# Altium schematic sheet NIM_to_LVCMOS.SchDoc: NIM Receiver
size A; Date: 2023/02/01; DrawnBy: dgl/anp; Organization: Boston University; DocumentNumber: 1; Revision: 1; SheetNumber: 1; SheetTotal: 1
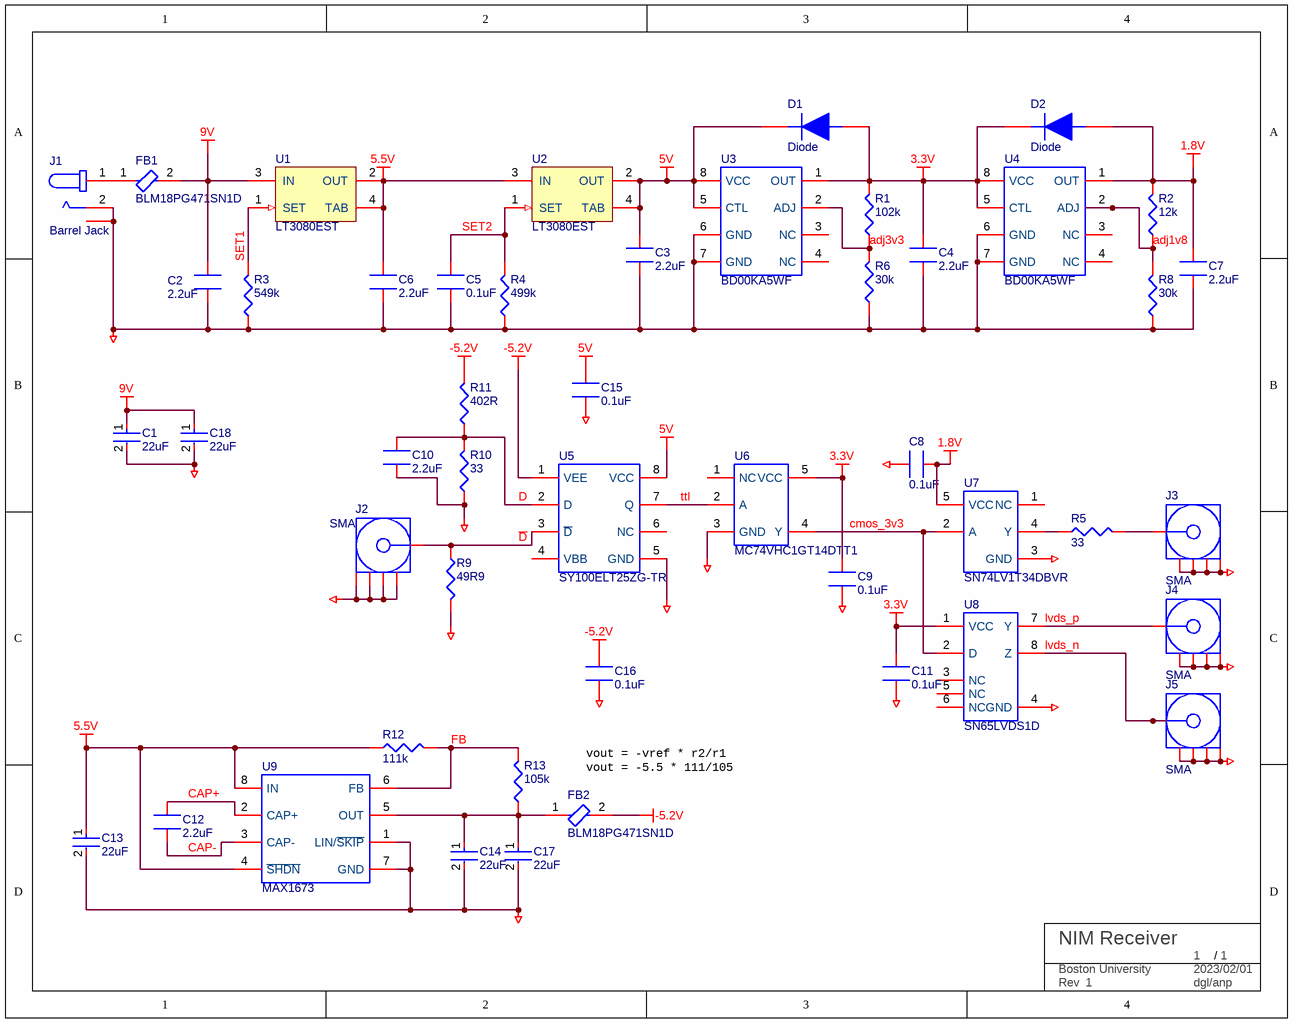
[diagram p0: NIM_to_LVCMOS.SchDoc]

## Parts
C1  22uF  [FP-CL31H-0_2-MFG]
C2  2.2uF  [CL21B225KAFNFNE]
C3  2.2uF  [CL21B225KAFNFNE]
C4  2.2uF  [CL21B225KAFNFNE]
C5  0.1uF  [CL21B104KACNNNC]
C6  2.2uF  [CL21B225KAFNFNE]
C7  2.2uF  [CL21B225KAFNFNE]
C8  0.1uF  [CL21B104KACNNNC]
C9  0.1uF  [CL21B104KACNNNC]
C10  2.2uF  [CL21B225KAFNFNE]
C11  0.1uF  [CL21B104KACNNNC]
C12  2.2uF  [CL21B225KAFNFNE]
C13  22uF  [FP-CL31H-0_2-MFG]
C14  22uF  [FP-CL31H-0_2-MFG]
C15  0.1uF  [CL21B104KACNNNC]
C16  0.1uF  [CL21B104KACNNNC]
C17  22uF  [FP-CL31H-0_2-MFG]
C18  22uF  [FP-CL31H-0_2-MFG]
D1  Diode  [BA679S-GS08]
D2  Diode  [BA679S-GS08]
FB1  BLM18PG471SN1D  [FP-BLM18-0_15-t0_8-MFG]
FB2  BLM18PG471SN1D  [FP-BLM18-0_15-t0_8-MFG]
J1  Barrel Jack  [PJ-063AH]
J2  SMA  [RF249BT0050GHDW]
J3  SMA  [RF249BT0050GHDW]
J4  SMA  [RF249BT0050GHDW]
J5  SMA  [RF249BT0050GHDW]
R1  102k  [R0805]
R2  12k  [R0805]
R3  549k  [R0805]
R4  499k  [R0805]
R5  33  [R0805]
R6  30k  [R0805]
R8  30k  [R0805]
R9  49R9  [R0805]
R10  33  [R0805]
R11  402R  [R0805]
R12  111k  [R0805]
R13  105k  [R0805]
TBLOCK?  BU Title block  (value not drawn)  (graphical)
U1  LT3080EST  [LT-ST-3-SOT-223_N]
U2  LT3080EST  [LT-ST-3-SOT-223_N]
U3  BD00KA5WF  [BD00KA5WF-E2]
U4  BD00KA5WF  [BD00KA5WF-E2]
U5  SY100ELT25ZG-TR  [SY100ELT25ZG-TR]
U6  MC74VHC1GT14DTT1  [MC74VHC1GT14DTT1]
U7  SN74LV1T34DBVR  [SN74LV1T34-DBV]
U8  SN65LVDS1D  [SN65LVDS1D]
U9  MAX1673  [MAX1673ESA+T]

## Nets
1.8V: C7.2 C8.2 D2.2 R2.2 U4.1(OUT) U7.5(VCC)
3.3V: C4.1 C9.1 C11.1 D1.2 D2.1 R1.2 U3.1(OUT) U4.5(CTL) U4.8(VCC) U6.5(VCC) U8.1(VCC)
5.5V: C6.1 C13.1 R12.1 U1.2(OUT) U1.4(TAB) U2.3(IN) U9.4(~{SHDN}) U9.8(IN)
5V: C3.1 C15.2 D1.1 U2.2(OUT) U2.4(TAB) U3.5(CTL) U3.8(VCC) U5.8(VCC)
9V: C1.1 C2.1 C18.1 FB1.2 U1.3(IN)
-5.2V: C16.2 FB2.2 R11.2 U5.1(VEE)
GND: C1.2 C2.2 C3.2 C4.2 C5.2 C6.2 C7.1 C8.1 C9.2 C10.2 C11.2 C13.2 C14.2 C15.1 C16.1 C17.2 C18.2 J1.2 J1.S1(SHIELD) J1.S2(SHIELD) J2.2 J2.3 J2.4 J2.5 J3.2 J3.3 J3.4 J3.5 J4.2 J4.3 J4.4 J4.5 J5.2 J5.3 J5.4 J5.5 R3.1 R4.1 R6.1 R8.1 R9.2 R10.1 U3.6(GND) U3.7(GND) U4.6(GND) U4.7(GND) U5.5(GND) U6.3(GND) U7.3(GND) U8.4(GND) U9.1(LIN/~{SKIP}) U9.7(GND)
adj1v8: R2.1 R8.2 U4.2(ADJ)
adj3v3: R1.1 R6.2 U3.2(ADJ)
CAP+: C12.1 U9.2(CAP+)
CAP-: C12.2 U9.3(CAP-)
cmos_3v3: U6.4(Y) U7.2(A) U8.2(D)
D: C10.1 R10.2 R11.1 U5.2(D)
~{D}: J2.1 R9.1 U5.3(~{D})
FB: R12.2 R13.2 U9.6(FB)
lvds_n: J5.1 U8.8(Z)
lvds_p: J4.1 U8.7(Y)
SET1: R3.2 U1.1(SET)
SET2: C5.1 R4.2 U2.1(SET)
ttl: U5.7(Q) U6.2(A)
NetC14_1: C14.1 C17.1 FB2.1 R13.1 U9.5(OUT)
NetFB1_1: FB1.1 J1.1
NetJ3_1: J3.1 R5.2
NetR5_1: R5.1 U7.4(Y)

Not connected (* = marked no-connect by the designer): U3 3(NC) 4(NC); U4 3(NC) 4(NC); U5 4(VBB) 6(NC); U6 1(NC); U7 1(NC); U8 3(NC) 5(NC) 6(NC)

## Notes on the sheet
- vout = -vref * r2/r1
- (near FB2) vout = -5.5 * 111/105
- (in symbol TITLE_BLOCK_BU) /; Rev

## Library data of the parts
C1 C13 C14 C17 C18 = CMP-13271-000012-1: CAP CER 22UF 25V X5R 1206; Manufacturer Part Number: CL31A226KAHNNNE; Manufacturer: Samsung; Temperature Coefficient: 15%; Tolerance: 10%; Description: Cap Ceramic 22uF 25V X5R 10% SMD 1206 85C Embossed T/R; Material: Ceramic; Automotive: No; Device Class L3: Ceramic Capacitors; Temperature: -55°C to +85°C; Octopart: https://octopart.com/cl31a226kahnnne-samsung-19832795; Temperature Range Low: -55°C; Voltage Rating: 25V; Height: 1.8mm; Temperature Characteristic: X5R; Package: CL31H-0.2; Temperature Range High: +85°C; ComponentLink2URL: http://www.samsungsem.com/kr/support/product-search/mlcc/__icsFiles/afieldfile/2019/05/10/19-CL31A226KAHNNNE.pdf; Ipc Land Pattern Name: CAPC320160X160; Value: 22uF; Lead Free: Yes; Device Class L2: Capacitors; Device Class L1: Passive Components; Capacitance: 22uF; Digikey Description: CAP CER 22UF 25V X5R 1206; RoHS: TRUE; Category: Cap; ComponentLink2Description: Datasheet
C2-C4 C6 C7 C10 C12 = CL21B225KAFNFNE: CAP CER 2.2UF 25V X7R 0805; Manufacturer: Samsung; Tolerance: 10%; Supplier 1: Avnet; Manufacturer Part Number: CL21B225KAFNFNE; RoHS: Yes; Category: Ceramic Capacitors; Stock 1: 46000; Pricing 1: 2000=0.02328, 4000=0.02275, 8000=0.02221, 12000=0.02168, 16000=0.02114 (USD); Mount: Surface Mount; Case/Package: 0805; Case Code (Metric): 2012; Case Code (Imperial): 0805; Min Operating Temperature: -55°C; Max Operating Temperature: 125°C; Package Quantity: 1; Packaging: Tape and Reel; Capacitance: 2.2uF; Voltage Rating: 25V; Dielectric: X7R; Series: CL; Construction: Flat; Length: 0.079inch; Width: 0.049inch; Height: 1.25mm; Thickness: 0.053inch; Depth: 1.25mm; Radiation Hardening: No; Lead Free: Lead Free; RoHS Compliant: Yes; ComponentLink1URL: https://datasheet.ciiva.com/25798/cl21b225kafnfne-25798721.pdf?src-supplier=Digi-Key; ComponentLink1Description: https://datasheet.ciiva.com/25798/cl21b225kafnfne-25798721.pdf?src-supplier=Digi-Key; Supplier Part Number 1: CL21B225KAFNFNE
C5 C8 C9 C11 C15 C16 = CL21B104KACNNNC: CAP CER 0.1UF 25V X7R 0805; Manufacturer: Samsung; Capacitance: 100nF; Tolerance: 10%; Supplier 1: Newark; Manufacturer Part Number: CL21B104KACNNNC; RoHS: Yes; Category: Ceramic Capacitors; Stock 1: 16000; Pricing 1: 1=0.00700, 4000=0.00700 (USD); Mount: Surface Mount; Case/Package: 0805; Case Code (Metric): 2012; Case Code (Imperial): 0805; Contact Plating: Tin; Min Operating Temperature: -55°C; Max Operating Temperature: 125°C; Dielectric: X7R; Package Quantity: 1; Packaging: Tape and Reel; Voltage Rating: 25V; Voltage: 25V; Series: CL; Construction: Flat; Length: 2mm; Width: 0.049inch; Height: 0.85mm; Depth: 1.25mm; Thickness: 0.037inch; Radiation Hardening: No; RoHS Compliant: Yes; ComponentLink1URL: https://datasheet.ciiva.com/25801/cl21b104kacnnnc-25801824.pdf?src-supplier=Digi-Key; ComponentLink1Description: https://datasheet.ciiva.com/25801/cl21b104kacnnnc-25801824.pdf?src-supplier=Digi-Key; ComponentLink2URL: https://datasheet.ciiva.com/15216/getdatasheetpartid-355204-15216236.pdf?src-supplier=Verical; ComponentLink2Description: https://datasheet.ciiva.com/15216/getdatasheetpartid-355204-15216236.pdf?src-supplier=Verical; Supplier Part Number 1: 82AC9426
D1 D2 = BA679S-GS08: Diode PIN Attenuator 30V 2-Pin Mini-MELF SOD-80 T/R; Manufacturer: Vishay Semiconductors; Forward Voltage: 1V; Forward Current: 50mA; Current Rating: 50A; Element Configuration: Single; Diode Type: PIN - Single; Supplier 1: Digi-Key; Manufacturer Part Number: BA679S-GS08; RoHS: Yes; Category: Diodes; Stock 1: 7528; Pricing 1: 1=0.53000, 10=0.43000, 100=0.29270, 500=0.21954, 1000=0.16466 (USD); Mount: Surface Mount; Number of Pins: 2; Contact Plating: Tin,Silver; Min Operating Temperature: -55°C; Max Operating Temperature: 125°C; Packaging: Tape and Reel; Package Quantity: 2500; Reverse Voltage (DC): 30V; Max Current Rating: 50mA; Max Repetitive Reverse Voltage (Vrrm): 30V; Reverse Voltage: 30V; Series: -; RoHS Compliant: Yes; ComponentLink1URL: https://datasheet.ciiva.com/1240/1749354-1240855.pdf?src-supplier=Newark; ComponentLink1Description: https://datasheet.ciiva.com/1240/1749354-1240855.pdf?src-supplier=Newark; ComponentLink2URL: https://datasheet.ciiva.com/9424/ba679-9424319.pdf?src-supplier=Avnet; ComponentLink2Description: https://datasheet.ciiva.com/9424/ba679-9424319.pdf?src-supplier=Avnet; ComponentLink3URL: https://datasheet.ciiva.com/1179/ba679-1179241.pdf?src-supplier=Element14; ComponentLink3Description: https://datasheet.ciiva.com/1179/ba679-1179241.pdf?src-supplier=Element14; Supplier Part Number 1: 112-BA679S-GS08CT-ND
FB1 FB2 = CMP-0686-00587-3: Chip Ferrite Bead, 0603, 470Ω @ 100MHz, 0.2Ω, 25%, 1A; DC Resistance (DCR): 200mR; Number of Circuits: 1; Material: Steel; Impedance: 470R; Core Material: Ferrite; Width: 0.8mm; Termination: SMD/SMT; Series: BLM18P; Min Operating Temperature: -55°C; DC Resistance-Max: 200mR; Current Rating: 1A; Package Quantity: 1; Max Operating Temperature: 125°C; Military Standard: Not; REACH SVHC: No SVHC; Max Current Rating: 1A; Number of Pins: 2; RoHS Compliant: Yes; Tolerance: 25%; Packaging: Tape and Reel; Number of Lines: 1; Resistance: 200mR; Length: 1.6mm; Case Code (Metric): 1608; Depth: 0.8mm; Lead Free: Lead Free; Case/Package: 0603; Height: 0.8mm; Radiation Hardening: No; Test Frequency: 100MHz; Case Code (Imperial): 0603; Max DC Current: 1A; DC Current: 1A
J1 = PJ-063AH: 2.0 x 6.5 mm, 8.0 A, Horizontal, Through Hole, Shielded, Kinked Pins, Dc Power Jack Connector; Manufacturer: CUI; Gender: Male; Current Rating: 8A; Voltage Rating: 24V; Insulation Resistance: 100MR; Number of Conductors: 2; Supplier 1: Mouser; Manufacturer Part Number: PJ-063AH; RoHS: Yes; Category: Connectors; Mount: Through Hole; Contact Material: Copper; Contact Plating: Nickel; Housing Color: Black; Housing Material: Thermoplastic; Min Operating Temperature: -25°C; Max Operating Temperature: 85°C; Package Quantity: 500; Shielding: Shielded; Termination: Through Hole; Connector Type: Jack; Contact Gender: Male; Series: -; Orientation: Horizontal; Flammability Rating: UL94 V-0; Lead Free: Lead Free; RoHS Compliant: Yes; ComponentLink1URL: https://www.cui.com/product/resource/digikeypdf/pj-063ah.pdf?src-supplier=Digi-Key; ComponentLink1Description: https://www.cui.com/product/resource/digikeypdf/pj-063ah.pdf?src-supplier=Digi-Key; ComponentLink2URL: https://www.cui.com/product/resource/digikeypdf/pj-063ah.pdf?src-supplier=Arrow+Electronics; ComponentLink2Description: https://www.cui.com/product/resource/digikeypdf/pj-063ah.pdf?src-supplier=Arrow+Electronics; ComponentLink3URL: https://www.cui.com/product/resource/digikeypdf/pj-063ah.pdf?src-supplier=Mouser; ComponentLink3Description: https://www.cui.com/product/resource/digikeypdf/pj-063ah.pdf?src-supplier=Mouser; ComponentLink4URL: https://www.cui.com/product/resource/digikeypdf/pj-063ah.pdf?src-supplier=Onlinecomponents.com; ComponentLink4Description: https://www.cui.com/product/resource/digikeypdf/pj-063ah.pdf?src-supplier=Onlinecomponents.com; ComponentLink5URL: http://www.cui.com/Product/Resource/FuturePDF/PJ-063AH.pdf?src-supplier=Future+Electronics; ComponentLink5Description: http://www.cui.com/Product/Resource/FuturePDF/PJ-063AH.pdf?src-supplier=Future+Electronics; ComponentLink6URL: https://www.cui.com/product/resource/digikeypdf/pj-063ah.pdf?src-supplier=Verical; ComponentLink6Description: https://www.cui.com/product/resource/digikeypdf/pj-063ah.pdf?src-supplier=Verical; ComponentLink7URL: https://www.cui.com/product/resource/digikeypdf/pj-063ah.pdf?src-supplier=Quest; ComponentLink7Description: https://www.cui.com/product/resource/digikeypdf/pj-063ah.pdf?src-supplier=Quest; ComponentLink8URL: https://www.cui.com/product/resource/digikeypdf/pj-063ah.pdf?src-supplier=NAC+Semi; ComponentLink8Description: https://www.cui.com/product/resource/digikeypdf/pj-063ah.pdf?src-supplier=NAC+Semi; Supplier Part Number 1: 490-PJ-063AH
J2-J5 = RF2-49B-T-00-50-G-HDW: Conn SMA 0Hz to 6GHz 50Ohm Solder RA Thru-Hole RCP Gold; Manufacturer: Adam Equipment; Supplier 1: Arrow Electronics; Manufacturer Part Number: RF2-49B-T-00-50-G-HDW; RoHS: No; Category: RF / Coaxial Connectors; Stock 1: 26; Pricing 1: 1=3.05500, 10=2.75100, 25=2.58300, 50=2.49800, 100=2.35600, 300=2.04400, 500=1.97200 (USD); Supplier Part Number 1: RF2-49B-T-00-50-G-HDW
R1 = RC0805FR-07102KL: Res Thick Film 0805 102K Ohm 1% 1/8W ±100ppm/°C SMD Paper T/R; Manufacturer: Yageo; Resistance: 102kR; Power Rating: 125mW; Voltage Rating: 150V; Supplier 1: Newark; Manufacturer Part Number: RC0805FR-07102KL; RoHS: Yes; Category: Chip SMD Resistors; Stock 1: 24480; Pricing 1: 10=0.10000, 25=0.02900, 50=0.02100, 100=0.01200 (USD); Case/Package: 0805; Contact Plating: Tin,Matte,Lead; Case Code (Metric): 2012; Case Code (Imperial): 0805; Min Operating Temperature: -55°C; Max Operating Temperature: 155°C; Tolerance: 1%; Resistor Type: Thick Film; Temperature Coefficient: 100ppm/°C; Package Quantity: 1; Packaging: Tape and Reel; Number of Terminations: 2; Termination: SMD/SMT; Max Power Dissipation: 125mW; Voltage Rating (DC): 150V; Features: Moisture Resistant; Series: RC; Construction: Rectangular; Length: 2mm; Width: 0.049inch; Height: 0.024inch; Depth: 1.25mm; Radiation Hardening: No; Military Standard: Not; Lead Free: Lead Free; RoHS Compliant: Yes; ComponentLink1URL: https://datasheet.ciiva.com/2457/pyu-r-int-thick-7-2457663.pdf?src-supplier=Digi-Key; ComponentLink1Description: https://datasheet.ciiva.com/2457/pyu-r-int-thick-7-2457663.pdf?src-supplier=Digi-Key; ComponentLink2URL: https://datasheet.ciiva.com/2457/pyu-r-int-thick-7-2457664.pdf?src-supplier=Digi-Key; ComponentLink2Description: https://datasheet.ciiva.com/2457/pyu-r-int-thick-7-2457664.pdf?src-supplier=Digi-Key; ComponentLink3URL: https://datasheet.ciiva.com/2457/pyu-r-int-thick-7-2457662.pdf?src-supplier=Digi-Key; ComponentLink3Description: https://datasheet.ciiva.com/2457/pyu-r-int-thick-7-2457662.pdf?src-supplier=Digi-Key; Supplier Part Number 1: 32AK1123
R2 = RC0805JR-0712KL: Res Thick Film 0805 12K Ohm 5% 0.125W(1/8W) ±100ppm/C Pad SMD T/R; Manufacturer: Yageo; Resistance: 12kR; Temperature Coefficient: 100ppm/°C; Power Rating: 125mW; Voltage Rating: 150V; Supplier 1: Newark; Manufacturer Part Number: RC0805JR-0712KL; RoHS: Yes; Category: Chip SMD Resistors; Stock 1: 2308; Pricing 1: 10=0.10000, 25=0.02900, 50=0.02100, 100=0.01300, 250=0.01200, 500=0.01100 (USD); Case/Package: 0805; Contact Plating: Tin,Lead; Case Code (Imperial): 0805; Case Code (Metric): 2012; Size Code: 0805; Min Operating Temperature: -55°C; Max Operating Temperature: 155°C; Tolerance: 5%; Resistor Type: Thick Film; Packaging: Cut Tape; Package Quantity: 5000; Termination: SMD/SMT; Features: Moisture Resistant; Series: RC; Max Power Dissipation: 125mW; Number of Terminations: 2; Construction: Rectangular; Resistance Tolerance: 5%; Length: 2mm; Width: 1.25mm; Height: 0.5mm; Depth: 1.25mm; Radiation Hardening: No; Lead Free: Lead Free; Military Standard: Not; RoHS Compliant: Yes; ComponentLink1URL: https://datasheet.ciiva.com/7941/442941-7941880.pdf?src-supplier=Element14; ComponentLink1Description: https://datasheet.ciiva.com/7941/442941-7941880.pdf?src-supplier=Element14; ComponentLink2URL: https://datasheet.ciiva.com/7941/442941-7941881.pdf?src-supplier=Element14; ComponentLink2Description: https://datasheet.ciiva.com/7941/442941-7941881.pdf?src-supplier=Element14; ComponentLink3URL: https://datasheet.ciiva.com/17082/rc0805-17082649.pdf?src-supplier=Future+Electronics; ComponentLink3Description: https://datasheet.ciiva.com/17082/rc0805-17082649.pdf?src-supplier=Future+Electronics; Supplier Part Number 1: 26M6818
R3 = R0805 549k: 549 kOhms ±1% 0.125W, 1/8W Chip Resistor 0805 (2012 Metric) Automotive AEC-Q200, High Voltage Thick Film; Part: KTR10EZPF5493
R4 = R0805 499k: 499k kOhms ±1% 0.125W, 1/8W Chip Resistor 0805 (2012 Metric); Part: RC0805FR-07499KL
R5 R10 = RC0805FR-0733RL: Res Thick Film 0805 33 Ohm 1% 1/8W +/-100ppm/ßC Molded SMD Paper T/R; Manufacturer: Yageo; Resistance: 33R; Power Rating: 125mW; Voltage Rating: 150V; Temperature Coefficient: 100ppm/°C; Supplier 1: Avnet; Manufacturer Part Number: RC0805FR-0733RL; RoHS: Yes; Category: Chip SMD Resistors; Stock 1: 25000; Pricing 1: 5000=0.00227, 10000=0.00224, 20000=0.00217 (USD); Case/Package: 0805; Case Code (Imperial): 0805; Case Code (Metric): 2012; Size Code: 0805; Min Operating Temperature: -55°C; Max Operating Temperature: 155°C; Packaging: Tape and Reel; Tolerance: 1%; Package Quantity: 1; Termination: SMD/SMT; Resistor Type: Thick Film; Number of Terminations: 2; Max Power Dissipation: 125mW; Features: Moisture Resistant; Series: RC; Construction: Rectangular; Resistance Tolerance: 1%; Technology: THICK FILM; Length: 2mm; Width: 0.049inch; Height: 0.5mm; Depth: 1.25mm; Military Standard: Not; Lead Free: Lead Free; RoHS Compliant: Yes; ComponentLink1URL: https://datasheet.ciiva.com/11808/0900766b8106beab-11808886.pdf?src-supplier=RSComponents; ComponentLink1Description: https://datasheet.ciiva.com/11808/0900766b8106beab-11808886.pdf?src-supplier=RSComponents; ComponentLink2URL: https://datasheet.ciiva.com/46447/444164-46447578.pdf?src-supplier=Element14; ComponentLink2Description: https://datasheet.ciiva.com/46447/444164-46447578.pdf?src-supplier=Element14; ComponentLink3URL: https://datasheet.ciiva.com/2457/pyu-r-int-thick-7-2457741.pdf?src-supplier=Digi-Key; ComponentLink3Description: https://datasheet.ciiva.com/2457/pyu-r-int-thick-7-2457741.pdf?src-supplier=Digi-Key; ComponentLink4URL: https://datasheet.ciiva.com/2457/pyu-r-int-thick-7-2457742.pdf?src-supplier=Digi-Key; ComponentLink4Description: https://datasheet.ciiva.com/2457/pyu-r-int-thick-7-2457742.pdf?src-supplier=Digi-Key; ComponentLink5URL: https://datasheet.ciiva.com/2457/pyu-r-int-thick-7-2457740.pdf?src-supplier=Digi-Key; ComponentLink5Description: https://datasheet.ciiva.com/2457/pyu-r-int-thick-7-2457740.pdf?src-supplier=Digi-Key; ComponentLink6URL: https://datasheet.ciiva.com/5561/rc0805-257173-5561849.pdf?src-supplier=Mouser; ComponentLink6Description: https://datasheet.ciiva.com/5561/rc0805-257173-5561849.pdf?src-supplier=Mouser; ComponentLink7URL: https://datasheet.ciiva.com/7941/444164-7941773.pdf?src-supplier=Element14; ComponentLink7Description: https://datasheet.ciiva.com/7941/444164-7941773.pdf?src-supplier=Element14; ComponentLink8URL: https://datasheet.ciiva.com/7941/444164-7941772.pdf?src-supplier=Element14; ComponentLink8Description: https://datasheet.ciiva.com/7941/444164-7941772.pdf?src-supplier=Element14; ComponentLink9URL: https://datasheet.ciiva.com/17486/rc0805-17486554.pdf?src-supplier=Future+Electronics; ComponentLink9Description: https://datasheet.ciiva.com/17486/rc0805-17486554.pdf?src-supplier=Future+Electronics; Supplier Part Number 1: RC0805FR-0733RL
R6 R8 = RC0805JR-0730KL: Res Thick Film 0805 30K Ohm 5% 0.125W(1/8W) ±100ppm/C Pad SMD T/R; Manufacturer: Yageo; Resistance: 30kR; Temperature Coefficient: 100ppm/°C; Power Rating: 125mW; Voltage Rating: 150V; Supplier 1: Newark; Manufacturer Part Number: RC0805JR-0730KL; RoHS: Yes; Category: Chip SMD Resistors; Stock 1: 4349; Pricing 1: 10=0.01500, 25=0.01200, 50=0.00900, 100=0.00600 (USD); Case/Package: 0805; Contact Plating: Tin,Lead,Matte; Case Code (Imperial): 0805; Case Code (Metric): 2012; Size Code: 0805; Min Operating Temperature: -55°C; Max Operating Temperature: 155°C; Tolerance: 5%; Resistor Type: Thick Film; Packaging: Tape and Reel; Termination: SMD/SMT; Voltage Rating (DC): 150V; Features: Moisture Resistant; Series: RC; Max Power Dissipation: 125mW; Number of Terminations: 2; Construction: Rectangular; Length: 2mm; Depth: 1.25mm; Radiation Hardening: No; Military Standard: Not; Lead Free: Lead Free; RoHS Compliant: Yes; ComponentLink1URL: https://datasheet.ciiva.com/16747/rc0805-16747179.pdf?src-supplier=Future+Electronics; ComponentLink1Description: https://datasheet.ciiva.com/16747/rc0805-16747179.pdf?src-supplier=Future+Electronics; Supplier Part Number 1: 82AH8404
R9 = R0805 49R9: 49.9 kOhms ±1% 0.125W, 1/8W Chip Resistor 0805 (2012 Metric) Moisture Resistant Thick Film; Part: RC0805FR-0749K9L
R11 = R0805 402R: Part: RC0805FR-07402RL
R12 = R0805 111k: 111 kOhms ±1% 0.125W, 1/8W Chip Resistor 0805 (2012 Metric); Part: RNCP0805FTD11K0
R13 = R0805 105k: 105 kOhms ±1% 0.125W, 1/8W Chip Resistor 0805 (2012 Metric); Part: RMCF0805FT105K
TBLOCK? = TITLE_BLOCK_BU
U1 U2 = CMP-0472-00054-1: Adjustable 1.1 A Single Resistor Low Dropout Regulator, 0.3 mA Isupply, 3-pin SOT223 (ST-3), -40 to 125 degC; Manufacturer: Linear Technology; Vin Min(V): 1.2; Vin Max(V): 36; Extended Temp: E, I; Isupply(mA): 0.3; Initial Accuracy(%): 1; Mounting Technology: Surface Mount; ComponentLink1Description: Manufacturer URL; RoHS: FALSE; PackageVersion: Jun-10; ComponentLink2Description: Datasheet; ComponentLink2URL: http://cds.linear.com/docs/en/datasheet/3080fc.pdf; PartNumber: LT3080EST; PackageReference: ST-3; PackageDescription: 3-Pin Plastic SOT-223, Body 3.505 x 6.505 mm, Pitch 2.3 mm; DatasheetVersion: Rev. F; ComponentLink3URL: http://cds.linear.com/docs/en/packaging/SOT_3_05-08-1630.pdf; ComponentLink1URL: http://www.linear.com/; ComponentLink3Description: Package Specification
U3 U4 = BD00KA5WF-E2: LDO Regulator Pos 1V to 4V 0.5A Automotive 8-Pin SOP T/R; Manufacturer: Rohm; Output Current: 500mA; Dropout Voltage: 120mV; Number of Outputs: 1; Min Input Voltage: 2.3V; Max Input Voltage: 5.5V; Max Power Dissipation: 687.6mW; Reference Voltage: 758mV; Polarity: Positive; Output Type: Adjustable; Supplier 1: Digi-Key; Manufacturer Part Number: BD00KA5WF-E2; RoHS: Yes; Category: Voltage Regulators - Linear; Stock 1: 9113; Pricing 1: 1=1.69000, 10=1.50700, 25=1.43040, 100=1.17510, 250=1.09848, 500=0.97074, 1000=0.76638 (USD); Mount: Surface Mount; Case/Package: SOP; Number of Pins: 8; Contact Plating: Copper,Tin; Min Operating Temperature: -40°C; Max Operating Temperature: 105°C; Packaging: Tape and Reel; Max Output Current: 500mA; Output Voltage: 4V; Package Quantity: 1; Number of Regulators: 1; Min Output Voltage: 1V; Max Output Voltage: 4V; Series: -; Radiation Hardening: No; Lead Free: Lead Free; RoHS Compliant: Yes; ComponentLink1URL: https://datasheet.ciiva.com/26878/getdatasheetpartid-457808-26878767.pdf?src-supplier=Verical; ComponentLink1Description: https://datasheet.ciiva.com/26878/getdatasheetpartid-457808-26878767.pdf?src-supplier=Verical; ComponentLink2URL: https://datasheet.ciiva.com/22732/1747249-22732896.pdf?src-supplier=Element14; ComponentLink2Description: https://datasheet.ciiva.com/22732/1747249-22732896.pdf?src-supplier=Element14; ComponentLink3URL: https://datasheet.ciiva.com/2040/bdxxka5-e-2040541.pdf?src-supplier=Digi-Key; ComponentLink3Description: https://datasheet.ciiva.com/2040/bdxxka5-e-2040541.pdf?src-supplier=Digi-Key; ComponentLink4URL: https://datasheet.ciiva.com/2040/bdxxka5-e-2040542.pdf?src-supplier=Digi-Key; ComponentLink4Description: https://datasheet.ciiva.com/2040/bdxxka5-e-2040542.pdf?src-supplier=Digi-Key; ComponentLink5URL: https://datasheet.ciiva.com/2040/bdxxka5-e-2040543.pdf?src-supplier=Digi-Key; ComponentLink5Description: https://datasheet.ciiva.com/2040/bdxxka5-e-2040543.pdf?src-supplier=Digi-Key; Supplier Part Number 1: BD00KA5WF-E2CT-ND
U5 = SY100ELT25ZG-TR: Dual Diff Ecl To Ttl Translator, 8 Soic 3.90Mm(.150In) T/R; Manufacturer: Microchip; Number of Channels: 1; Propagation Delay: 3.6ns; Operating Supply Voltage: 5V; Max Supply Voltage: 5.5V; Min Supply Voltage: 4.5V; Channel Type: Unidirectional; High Level Output Current: -3mA; Low Level Output Current: 24mA; Supplier 1: Digi-Key; Manufacturer Part Number: SY100ELT25ZG-TR; RoHS: Yes; Category: Clock Buffers, Drivers; Stock 1: 1000; Pricing 1: 1=4.65000, 25=3.87960, 100=3.52980 (USD); Mount: Surface Mount; Case/Package: SOIC; Number of Pins: 8; Min Operating Temperature: -40°C; Max Operating Temperature: 85°C; Package Quantity: 1000; Packaging: Tape and Reel; Number of Circuits: 1; Logic Function: Translator; Number of Bits: 1; Turn-On Delay Time: 3.6ns; Output Type: TTL; Series: 100ELT; Technology: ECL; Lead Free: Lead Free; RoHS Compliant: Yes; ComponentLink1URL: https://datasheet.ciiva.com/1901/sy100elt25-1901076.pdf?src-supplier=Digi-Key; ComponentLink1Description: https://datasheet.ciiva.com/1901/sy100elt25-1901076.pdf?src-supplier=Digi-Key; Supplier Part Number 1: 150-SY100ELT25ZG-TRCT-ND
U6 = MC74VHC1GT14DTT1: Inverter Schmitt Trigger Sgl Cmos 5TSOP; Manufacturer: ON Semiconductor; Max Supply Voltage: 5.5V; Min Supply Voltage: 3V; Number of Inputs: 1; Output Current: 8mA; Logic Function: Schmitt Trigger,Inverter; High Level Output Current: -8mA; Supplier 1: Mouser; Manufacturer Part Number: MC74VHC1GT14DTT1; RoHS: No; Category: Logic Gates; Case/Package: SOT-23-5; Number of Pins: 5; Min Operating Temperature: -55°C; Max Operating Temperature: 125°C; Package Quantity: 3000; Packaging: Tape and Reel; Number of Circuits: 1; Low Level Output Current: 8mA; Number of Gates: 1; RoHS Compliant: No; Reach SVHC Compliant: Yes; Lead Free: Contains Lead; ComponentLink1URL: https://datasheet.ciiva.com/4828/mc74vhc1gt14-d-107443-4828755.pdf?src-supplier=Mouser; ComponentLink1Description: https://datasheet.ciiva.com/4828/mc74vhc1gt14-d-107443-4828755.pdf?src-supplier=Mouser; ComponentLink2URL: https://datasheet.ciiva.com/7970/mc74vhc1gt14-d-7970445.pdf?src-supplier=Element14; ComponentLink2Description: https://datasheet.ciiva.com/7970/mc74vhc1gt14-d-7970445.pdf?src-supplier=Element14; Supplier Part Number 1: 863-MC74VHC1GT14DTT1
U7 = SN74LV1T34DBVR: IC BUFFER GATE SGL CMOS SOT23-5; Manufacturer: Texas Instruments; Number of Elements: 1; Logic Function: Buffer,Inverting; High Level Output Current: -8mA; Low Level Output Current: 8mA; Max Supply Voltage: 5.5V; Min Supply Voltage: 1.6V; Polarity: Non-Inverting; Propagation Delay: 15.5ns; Quiescent Current: 1uA; Output Type: PUSH-PULL,3-STATE; Supplier 1: Arrow Electronics; Manufacturer Part Number: SN74LV1T34DBVR; RoHS: Yes; Category: Buffers, Drivers and Transceivers; Stock 1: 1800; Pricing 1: 1=0.51900, 10=0.42320, 100=0.26150, 500=0.21660, 1000=0.16270, 3000=0.14770 (USD); Mount: Surface Mount; Case/Package: SOT-23-5; Number of Pins: 5; Weight: 0.000353oz; Min Operating Temperature: -40°C; Max Operating Temperature: 125°C; Packaging: Tape and Reel; Number of Bits per Element: 1; Number of Bits: 1; Package Quantity: 3000; Number of Input Lines: 1; Number of Output Lines: 1; Operating Supply Current: 8mA; Number of Channels: 1; Number of Inputs: 1; Number of Outputs: 1; Series: 74LV; Technology: CMOS; Radiation Hardening: No; RoHS Compliant: Yes; Reach SVHC Compliant: Yes; Lead Free: Lead Free; ComponentLink1URL: https://datasheet.ciiva.com/29634/sn74lv1t34-29634759.pdf?src-supplier=Digi-Key; ComponentLink1Description: https://datasheet.ciiva.com/29634/sn74lv1t34-29634759.pdf?src-supplier=Digi-Key; ComponentLink2URL: https://datasheet.ciiva.com/29634/sn74lv1t34-29634758.pdf?src-supplier=Digi-Key; ComponentLink2Description: https://datasheet.ciiva.com/29634/sn74lv1t34-29634758.pdf?src-supplier=Digi-Key; ComponentLink3URL: https://datasheet.ciiva.com/29634/sn74lv1t34-29634760.pdf?src-supplier=Digi-Key; ComponentLink3Description: https://datasheet.ciiva.com/29634/sn74lv1t34-29634760.pdf?src-supplier=Digi-Key; ComponentLink4URL: https://datasheet.ciiva.com/29888/sn74lv1t34-29888041.pdf?src-supplier=Avnet; ComponentLink4Description: https://datasheet.ciiva.com/29888/sn74lv1t34-29888041.pdf?src-supplier=Avnet; Supplier Part Number 1: SN74LV1T34DBVR
U8 = SN65LVDS1D: 630-Mbps single LVDS driver 8-SOIC -40 to 85; Manufacturer: Texas Instruments; Data Rate: 630Mbps; Number of Receivers: 1; Operating Supply Voltage: 3.3V; Propagation Delay: 3.1ns; Max Supply Voltage: 3.6V; Min Supply Voltage: 2.4V; Power Dissipation: 725mW; Nominal Supply Current: 15mA; Supplier 1: Mouser; Manufacturer Part Number: SN65LVDS1D; RoHS: Yes; Category: Interface ICs; Stock 1: 778; Pricing 1: 1=2.57000, 10=2.32000, 25=2.19000, 50=2.19000, 75=1.86000, 100=1.86000, 300=1.74000, 525=1.53000, 1000=1.53000, 1050=1.27000, 10000=1.27000 (USD); Mount: Surface Mount; Case/Package: SOIC; Number of Pins: 8; Weight: 0.002561oz; Min Operating Temperature: -40°C; Max Operating Temperature: 85°C; Packaging: Rail/Tube; Package Quantity: 75; Number of Elements: 1; Number of Drivers: 1; Turn-On Delay Time: 3.1ns; Series: 65LVDS; Supply Current: 15mA; Max Power Dissipation: 725mW; Length: 4.9mm; Width: 3.91mm; Height: 1.58mm; Radiation Hardening: No; Lead Free: Lead Free; RoHS Compliant: Yes; Reach SVHC Compliant: Yes; ComponentLink1URL: https://datasheet.ciiva.com/15151/getdatasheetpartid-163203-15151570.pdf?src-supplier=Verical; ComponentLink1Description: https://datasheet.ciiva.com/15151/getdatasheetpartid-163203-15151570.pdf?src-supplier=Verical; ComponentLink2URL: https://datasheet.ciiva.com/1771/sn65lvds1-1771428.pdf?src-supplier=Digi-Key; ComponentLink2Description: https://datasheet.ciiva.com/1771/sn65lvds1-1771428.pdf?src-supplier=Digi-Key; ComponentLink3URL: https://datasheet.ciiva.com/3151/sn65lvdt2-3151544.pdf?src-supplier=Avnet; ComponentLink3Description: https://datasheet.ciiva.com/3151/sn65lvdt2-3151544.pdf?src-supplier=Avnet; ComponentLink4URL: https://datasheet.ciiva.com/41461/001187532-da-01-en-ic-hs-diff-line-dr-sn65lvds1d-soic-8-tid-41461269.pdf?src-supplier=Conrad; ComponentLink4Description: https://datasheet.ciiva.com/41461/001187532-da-01-en-ic-hs-diff-line-dr-sn65lvds1d-soic-8-tid-41461269.pdf?src-supplier=Conrad; Supplier Part Number 1: 595-SN65LVDS1D
U9 = MAX1673ESA+T: 5.5 V 125 mA 460kHz Charge Pump SMT Switching Regulator - SOIC-8; Manufacturer: Maxim; Output Voltage: -3.15V; Logic Function: Inverting; Number of Outputs: 1; Max Input Voltage: 5.5V; Output Current: 125mA; Switching Frequency: 350kHz; Synchronous Rectifier: No; Output Type: Adjustable; Supplier 1: Arrow Electronics; Manufacturer Part Number: MAX1673ESA+T; RoHS: Yes; Category: Voltage Regulators - Switching; Stock 1: 1576; Pricing 1: 1=6.45840, 10=5.76150, 25=5.40040, 100=4.64370, 250=4.36660, 500=3.88360, 1000=3.47760 (USD); Mount: Surface Mount; Case/Package: SOIC; Min Operating Temperature: -40°C; Max Operating Temperature: 85°C; Package Quantity: 2500; Packaging: Tape and Reel; Series: -; Width: 4mm; Radiation Hardening: No; Lead Free: Lead Free; RoHS Compliant: Yes; ComponentLink1URL: https://datasheet.ciiva.com/24013/max1673-85133-24013456.pdf?src-supplier=Mouser; ComponentLink1Description: https://datasheet.ciiva.com/24013/max1673-85133-24013456.pdf?src-supplier=Mouser; ComponentLink2URL: https://datasheet.ciiva.com/3216/max1673-3216094.pdf?src-supplier=Avnet; ComponentLink2Description: https://datasheet.ciiva.com/3216/max1673-3216094.pdf?src-supplier=Avnet; ComponentLink3URL: https://datasheet.ciiva.com/2037/max1673-2037237.pdf?src-supplier=Digi-Key; ComponentLink3Description: https://datasheet.ciiva.com/2037/max1673-2037237.pdf?src-supplier=Digi-Key; Supplier Part Number 1: MAX1673ESA+T